# EAGLE design isd tower lighting board-v2 (EAGLE 9.6.2)
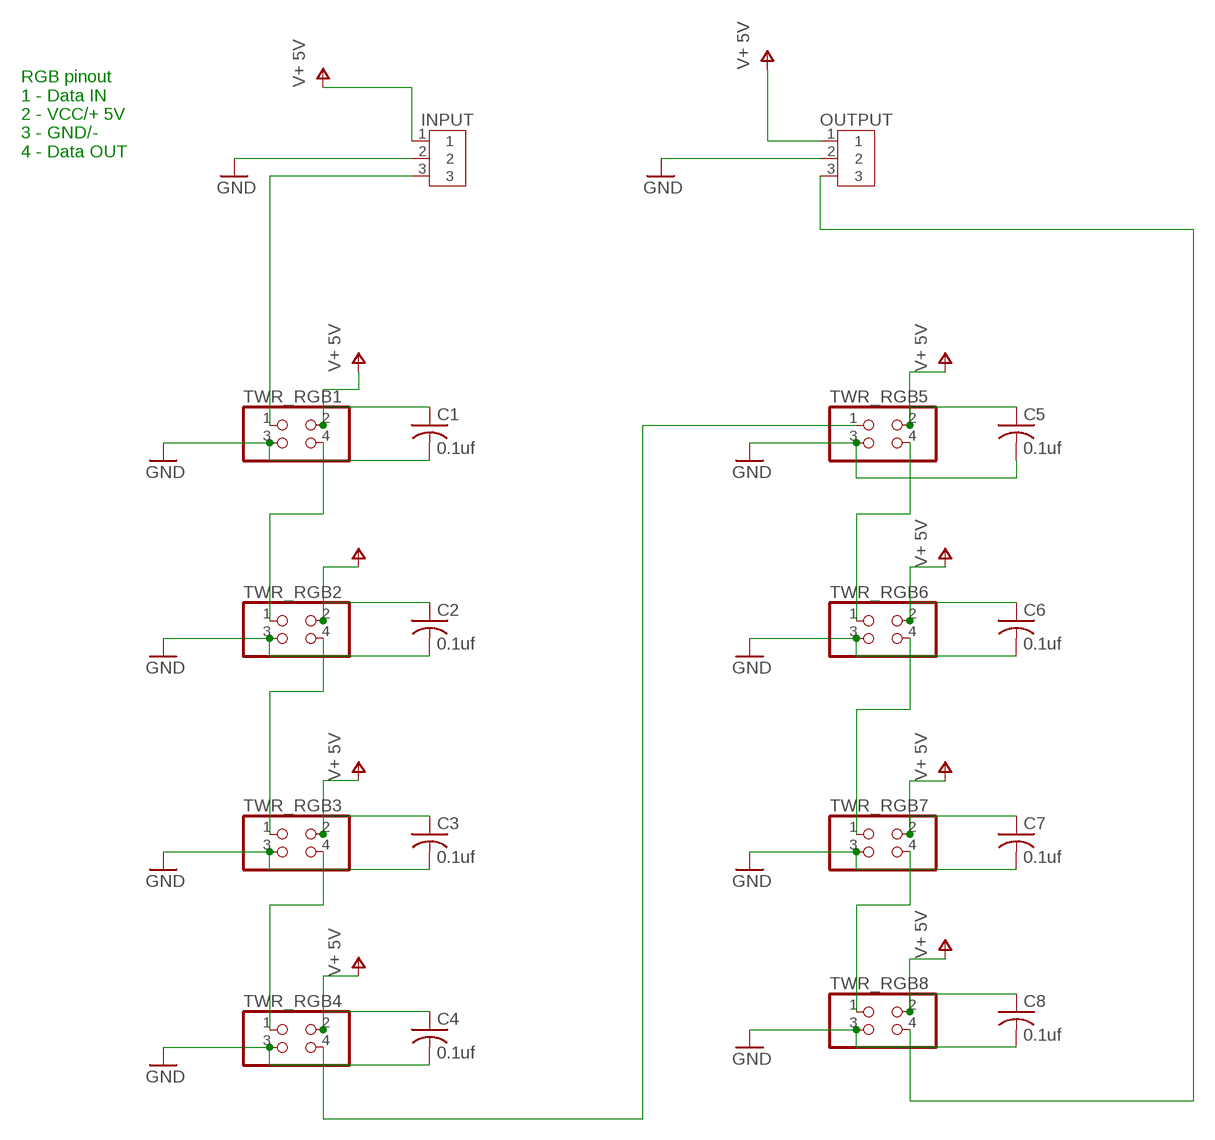
[diagram p0: schematic, sheet 1]

## Parts
C1  0.1uf  C-USC0805  [C0805]
C2  0.1uf  C-USC0805  [C0805]
C3  0.1uf  C-USC0805  [C0805]
C4  0.1uf  C-USC0805  [C0805]
C5  0.1uf  C-USC0805  [C0805]
C6  0.1uf  C-USC0805  [C0805]
C7  0.1uf  C-USC0805  [C0805]
C8  0.1uf  C-USC0805  [C0805]
INPUT  B3B-XH-A  [B3B-XH-A]
OUTPUT  B3B-XH-A  [B3B-XH-A]
TWR_RGB1  PINHD-2X2  [2X02]
TWR_RGB2  PINHD-2X2  [2X02]
TWR_RGB3  PINHD-2X2  [2X02]
TWR_RGB4  PINHD-2X2  [2X02]
TWR_RGB5  PINHD-2X2  [2X02]
TWR_RGB6  PINHD-2X2  [2X02]
TWR_RGB7  PINHD-2X2  [2X02]
TWR_RGB8  PINHD-2X2  [2X02]

## Nets
GND: C1.2 C2.2 C3.2 C4.2 C5.2 C6.2 C7.2 C8.2 INPUT.2 OUTPUT.2 TWR_RGB1.3 TWR_RGB2.3 TWR_RGB3.3 TWR_RGB4.3 TWR_RGB5.3 TWR_RGB6.3 TWR_RGB7.3 TWR_RGB8.3
N$1: INPUT.3 TWR_RGB1.1
N$2: TWR_RGB5.4 TWR_RGB6.1
N$3: TWR_RGB6.4 TWR_RGB7.1
N$4: TWR_RGB7.4 TWR_RGB8.1
N$5: TWR_RGB4.4 TWR_RGB5.1
N$6: TWR_RGB3.4 TWR_RGB4.1
N$7: TWR_RGB2.4 TWR_RGB3.1
N$8: TWR_RGB1.4 TWR_RGB2.1
N$9: OUTPUT.3 TWR_RGB8.4
V+: C1.1 C2.1 C3.1 C4.1 C5.1 C6.1 C7.1 C8.1 INPUT.1 OUTPUT.1 TWR_RGB1.2 TWR_RGB2.2 TWR_RGB3.2 TWR_RGB4.2 TWR_RGB5.2 TWR_RGB6.2 TWR_RGB7.2 TWR_RGB8.2 ; supply symbol labelled V+ 5V

## Notes on the sheet
- RGB pinout
  1 - Data IN
  2 - VCC/+ 5V
  3 - GND/-
  4 - Data OUT

## Library data of the parts
C1-C8 = adafruit:C-US: CAPACITOR, American symbol
INPUT OUTPUT = Connector:B3B-XH-A: XH Connector Top Entry - 3POS Details see: Datasheet <http://www.jst-mfg.com/product/pdf/eng/eXH.pdf>; CATEGORY: CONNECTOR; DESCRIPTION: 2.5mm pitch/disconnectable crimp style connector; MANUFACTURER: JST (XH connector); MPN: B3B-XH-A; PART_STATUS: ACTIVE; ROHS_COMPLIANT: COMPLIANT; SERIES: B3B-XH-A; SUB_CATEGORY: THROUGH HOLE CONNECTOR; TYPE: SIDE ENTRY; VALUE: 3A/250V
TWR_RGB1-TWR_RGB8 = pinhead:PINHD-2X2: PIN HEADER

## Board
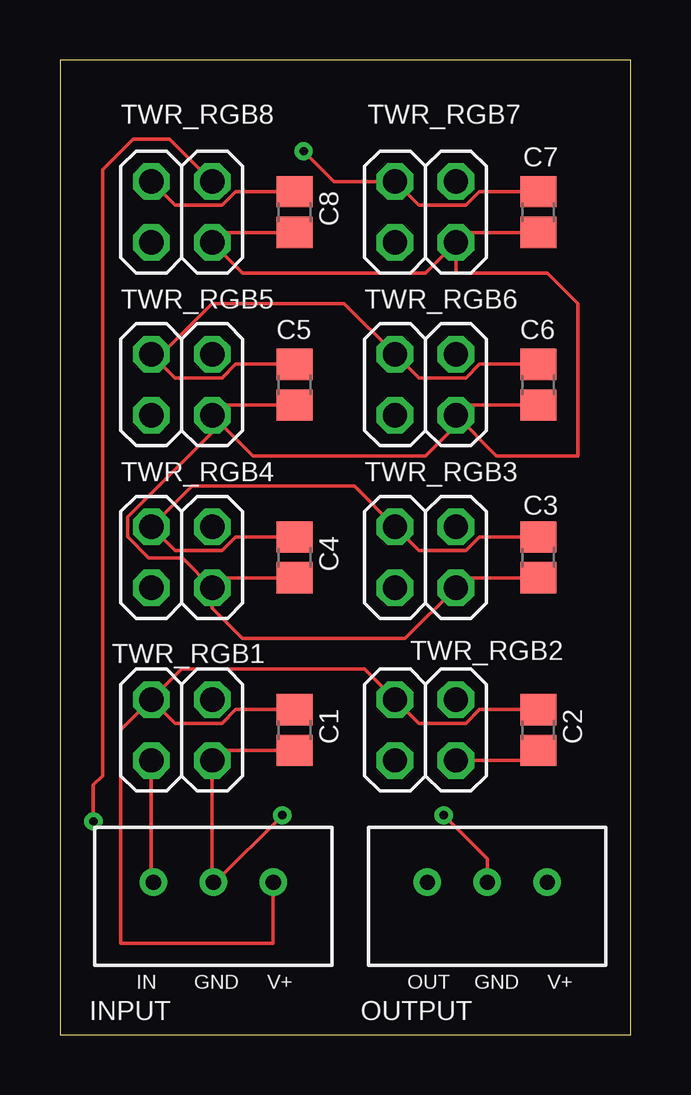
[diagram p1: board, top side]
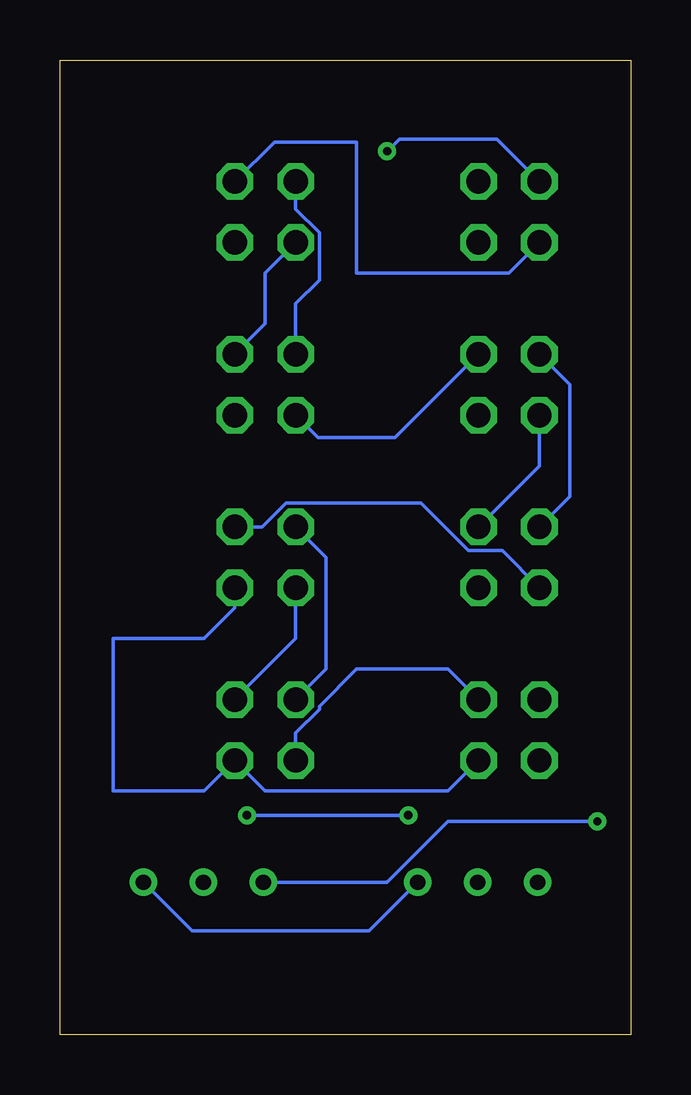
[diagram p2: board, bottom side, seen from below]

Size 23.8 x 40.63 mm. Coordinates in mm from the lower left corner, seen from the top.
Outline: 0,0 23.8,0 23.8,40.63 0,40.63 0,0
Copper layers (1*16): Top 0.035mm / dielectric 1.5mm / Bottom 0.035mm
Design rules "default": minimum track width 6mil, minimum drill 0.35mm, track to track 6mil, track to pad 6mil, pad to pad 6mil, via to via 6mil, smd to smd 6mil, copper to edge 40mil, drill to drill 6mil, minimum pad ring 10mil, minimum via ring 8mil, stop-mask expansion 4mil, vias tented up to drill 0mil, thermal gap 10mil

### Footprints (pad centres in the part's own frame; a part is rotated, then mirrored left to right if it is on the bottom)
C0805 = smd 1.3 x 1.5: 1 -0.85,0; 2 0.85,0
B3B-XH-A = drill 0.64: 1 0,0; 2 2.5,0; 3 5,0
2X02 = drill 1.016 octagon: 1 -1.27,-1.27; 2 -1.27,1.27; 3 1.27,-1.27; 4 1.27,1.27

### Placement (x,y rotation side)
C1  9.78,12.7 270 top
C2  19.94,12.7 270 top
C3  19.94,19.9 270 top
C4  9.78,19.9 270 top
C5  9.78,27.09 270 top
C6  19.94,27.09 270 top
C7  19.94,34.29 270 top
C8  9.78,34.29 270 top
INPUT  8.89,6.35 180 top
OUTPUT  20.32,6.35 180 top
TWR_RGB1  5.08,12.7 0 top
TWR_RGB2  15.24,12.7 0 top
TWR_RGB3  15.24,19.9 0 top
TWR_RGB4  5.08,19.9 0 top
TWR_RGB5  5.08,27.09 0 top
TWR_RGB6  15.24,27.09 0 top
TWR_RGB7  15.24,34.29 0 top
TWR_RGB8  5.08,34.29 0 top

### Tracks (layer width: path | path; a pad name or v marks a point on that pad's centre or on a via)
GND  (via drill 0.35)
  Top 0.152: v9.27,9.14 6.48,6.35 INPUT.2 6.35,6.39 TWR_RGB1.3 6.77,11.85 C1.2 | OUTPUT.2 17.82,7.33 v16,9.14 | C2.2 19.52,11.43 TWR_RGB2.3 | C3.2 16.93,19.05 TWR_RGB3.3 14.39,16.51 7.62,16.51 6.35,17.78 TWR_RGB4.3 | C6.2 16.93,26.24 TWR_RGB6.3 | C7.2 16.93,33.44 TWR_RGB7.3 | C8.2 6.77,33.44 TWR_RGB8.3 | TWR_RGB8.3 | C5.2 6.77,26.24 TWR_RGB5.3 | C4.2 6.77,19.05 TWR_RGB4.3 | TWR_RGB5.3 8.04,24.13 15.24,24.13 16.51,25.4 TWR_RGB6.3 | TWR_RGB6.3 18.2,24.13 21.59,24.13 21.59,30.48 20.32,31.75 16.51,31.75 TWR_RGB7.3 | TWR_RGB7.3 15.24,31.75 7.62,31.75 TWR_RGB8.3 | TWR_RGB8.3 | TWR_RGB4.3 5.11,19.87 3.7,19.87 2.82,20.76 2.82,21.58 6.35,25.11 TWR_RGB5.3
  Bottom 0.152: v16,9.14 v9.27,9.14 | TWR_RGB1.3 7.62,10.16 15.24,10.16 TWR_RGB2.3 17.78,10.16 21.59,10.16 21.59,16.51 17.78,16.51 16.51,17.78 TWR_RGB3.3
N$1
  Top 0.152: INPUT.3 3.81,6.43 TWR_RGB1.1
N$2
  Bottom 0.152: TWR_RGB6.1 13.04,24.89 9.82,24.89 TWR_RGB5.4
N$3
  Bottom 0.152: TWR_RGB6.4 15.24,29.63 15.24,31.75 TWR_RGB7.1
N$4
  Bottom 0.152: TWR_RGB7.4 14.86,37.21 11.43,37.21 11.43,31.75 5.08,31.75 TWR_RGB8.1
N$5
  Bottom 0.152: TWR_RGB4.4 3.81,23.71 TWR_RGB5.1
N$6
  Bottom 0.152: TWR_RGB3.4 15.37,21.17 14.38,22.16 8.74,22.16 6.76,20.18 5.36,20.18 TWR_RGB4.1
N$7
  Bottom 0.152: TWR_RGB2.4 13.97,16.51 TWR_RGB3.1
N$8
  Bottom 0.152: TWR_RGB1.4 7.62,15.24 11.43,15.24 12.98,13.69 12.98,13.56 13.97,12.57 TWR_RGB2.1
N$9  (via drill 0.35)
  Top 0.152: v1.39,8.89 1.39,10.41 1.77,10.79 1.77,36.06 3.05,37.34 4.57,37.34 TWR_RGB8.4
  Bottom 0.152: 6.73,8.89 v1.39,8.89 7.62,8.89 10.16,6.35 OUTPUT.3
V+  (via drill 0.35)
  Top 0.152: C1.1 7.33,13.55 6.76,12.98 4.8,12.98 TWR_RGB1.2 | C5.1 7.33,27.94 6.76,27.37 4.8,27.37 TWR_RGB5.2 4.23,28.36 6.35,30.48 11.85,30.48 TWR_RGB6.2 14.96,27.37 16.92,27.37 17.49,27.94 C6.1 | C4.1 7.33,20.75 6.76,20.18 4.8,20.18 TWR_RGB4.2 5.5,22.86 12.28,22.86 TWR_RGB3.2 14.96,20.18 16.92,20.18 17.49,20.75 C3.1 | C8.1 7.33,35.14 6.76,34.57 4.8,34.57 TWR_RGB8.2 | C7.1 17.49,35.14 16.92,34.57 14.96,34.57 TWR_RGB7.2 11.43,35.56 v10.16,36.83 | TWR_RGB1.2 5.08,15.24 12.7,15.24 TWR_RGB2.2 14.96,12.98 16.92,12.98 17.49,13.55 C2.1 | INPUT.1 8.89,3.81 2.54,3.81 2.54,12.7 TWR_RGB1.2
  Bottom 0.152: TWR_RGB2.2 12.7,15.24 12.7,19.9 TWR_RGB3.2 | TWR_RGB6.2 13.97,30.47 12.98,31.46 12.98,33.43 13.97,34.42 TWR_RGB7.2 | TWR_RGB8.2 | TWR_RGB4.2 2.54,22.44 2.54,27.09 TWR_RGB5.2 | v10.16,36.83 9.65,37.34 5.59,37.34 TWR_RGB8.2 | INPUT.1 10.92,4.32 18.29,4.32 OUTPUT.1

### Text on the board
tPlace: IN | GND | V+ | OUT | GND | V+